# EAGLE design Main_board (EAGLE 7.4.0)
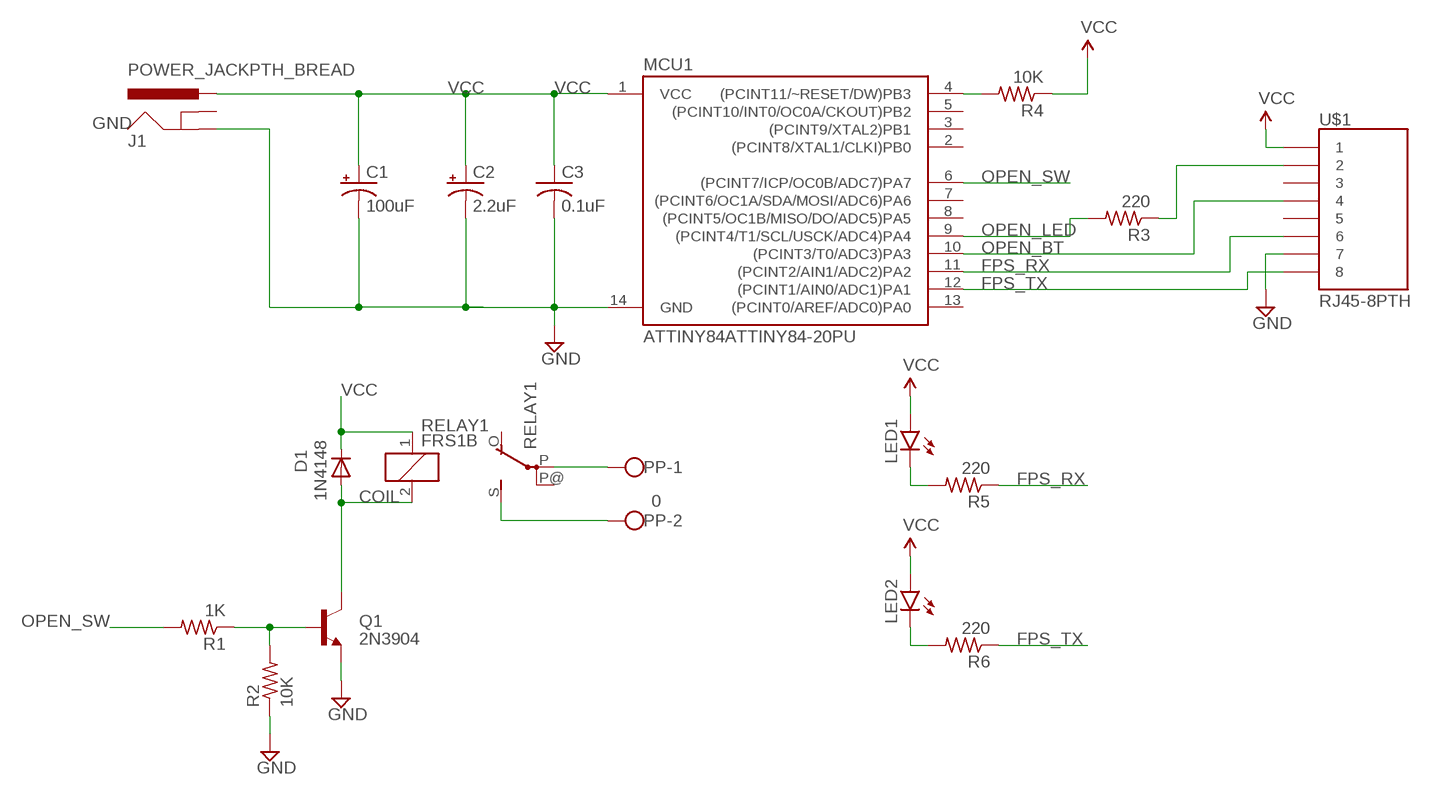
[diagram p0: schematic, sheet 1]

## Parts
C1  100uF  CAP_POLPTH2  [CPOL-RADIAL-10UF-25V]
C2  2.2uF  CAP_POLPTH2  [CPOL-RADIAL-10UF-25V]
C3  0.1uF  C-US025-024X044  [C025-024X044]
D1  1N4148  DIODE1N4148  [DIODE-1N4148]
J1  POWER_JACKPTH_BREAD  [POWER_JACK_PTH_BREAD]
LED1  LED3MM  [LED3MM]
LED2  LED3MM  [LED3MM]
MCU1  ATTINY84ATTINY84-20PU  [DIL14]
PP  0  W237-102  [W237-102]
Q1  2N3904  TRANSISTOR_NPNTO92  [TO-92]
R1  1K  R-US_0207/10  [0207/10]
R2  10K  R-US_0207/10  [0207/10]
R3  220  R-US_0207/10  [0207/10]
R4  10K  R-US_0207/10  [0207/10]
R5  220  R-US_0207/10  [0207/10]
R6  220  R-US_0207/10  [0207/10]
RELAY1  FRS1B  [FRS1B]
U$1  RJ45-8PTH  [RJ45-8]

## Nets
COIL [power]: D1.A Q1.3(C) RELAY1.2
FPS_RX: MCU1.11((PCINT2/AIN1/ADC2)PA2) R5.1 U$1.6
FPS_TX: MCU1.12((PCINT1/AIN0/ADC1)PA1) R6.1 U$1.8
GND [power]: C1.2(-) C2.2(-) C3.2 J1.GND MCU1.14(GND) Q1.1(E) R2.1 U$1.7
N$1: Q1.2(B) R1.1 R2.2
N$2 [power]: PP.2 RELAY1.S(2:S)
N$3 [power]: PP.1 RELAY1.P(2:P)
N$4: LED2.K(C) R6.2
N$5: MCU1.4((PCINT11/~RESET/DW)PB3) R4.2
N$6: LED1.K(C) R5.2
N$10: R3.1 U$1.2
OPEN_BT: MCU1.10((PCINT3/T0/ADC3)PA3) U$1.4
OPEN_LED: MCU1.9((PCINT4/T1/SCL/USCK/ADC4)PA4) R3.2
OPEN_SW: MCU1.6((PCINT7/ICP/OC0B/ADC7)PA7) R1.2
VCC [power]: C1.1(+) C2.1(+) C3.1 D1.C J1.PWR LED1.A LED2.A MCU1.1(VCC) R4.1 RELAY1.1 U$1.1
Unconnected: J1.GNDBREAK MCU1.2((PCINT8/XTAL1/CLKI)PB0) MCU1.3((PCINT9/XTAL2)PB1) MCU1.5((PCINT10/INT0/OC0A/CKOUT)PB2) MCU1.7((PCINT6/OC1A/SDA/MOSI/ADC6)PA6) MCU1.8((PCINT5/OC1B/MISO/DO/ADC5)PA5) MCU1.13((PCINT0/AREF/ADC0)PA0) RELAY1.O(2:O) RELAY1.P@(2:P) U$1.3 U$1.5

## Library data of the parts
C1 C2 = SparkFun-Capacitors:CAP_POL: Capacitor Polarized These are standard SMD and PTH capacitors. Normally 10uF, 47uF, and 100uF in electrolytic and tantalum varieties. Always verify the external diameter of the through hole cap, it varies with capacity, voltage, and manufacturer. The EIA devices should be standard.
C3 = adafruit:C-US: CAPACITOR, American symbol
D1 = SparkFun:DIODE: Diode These are standard reverse protection diodes and small signal diodes. SMA package can handle up to about 1A. SOD-323 can handle about 200mA. What the SOD-323 package when ordering, there are some mfgs out there that are 5-pin packages.
J1 = SparkFun-Connectors:POWER_JACK: Power Jack This is the standard 5.5mm barrel jack for power. The PTH is the most common, proven, reliable, footprint. The Slot footprint only works if the mill layer is transmitted to the PCB fab house so be warned. Mating wall wart : TOL-00298 (and others); PROD_ID: PRT-10811
LED1 LED2 = SparkFun-LED:LED: LEDs Standard schematic elements and footprints for 5mm, 3mm, 1206, and 0603 sized LEDs. 5mm - Spark Fun Electronics SKU : COM-00529 (and others)
MCU1 = SparkFun-DigitalIC:ATTINY84: Atmel 14-pin 2/4/8kB flash uC
PP = con-wago-500:W237-102: WAGO SCREW CLAMP
Q1 = SparkFun:TRANSISTOR_NPN: Transistor NPN BJT configuration in SOT23 package. MMBT2222 is the common NPN we use. Double check BCE configuration again layout.
R1-R6 = rcl:R-US_: RESISTOR, American symbol
RELAY1 = relay:FRS1B: RELAY 1 x switch, same as V23101-D6-A201, Siemens
U$1 = SparkFun-Connectors:RJ45-8: RJ45 Jack Simple RJ45, 8-pin connection - connector for common Cat5, Cat5e, and Cat6 Ethernet cables. Footprint not yet proven in production. Connector sku is PRT-00643; Breakout PCB sku is BOB-00716.

## Net classes
0 signal: width 0.381 mm, drill 0.508 mm, clearance 0.254 mm
1 power: width 0.635 mm, drill 0.508 mm, clearance 0.559 mm

## Board
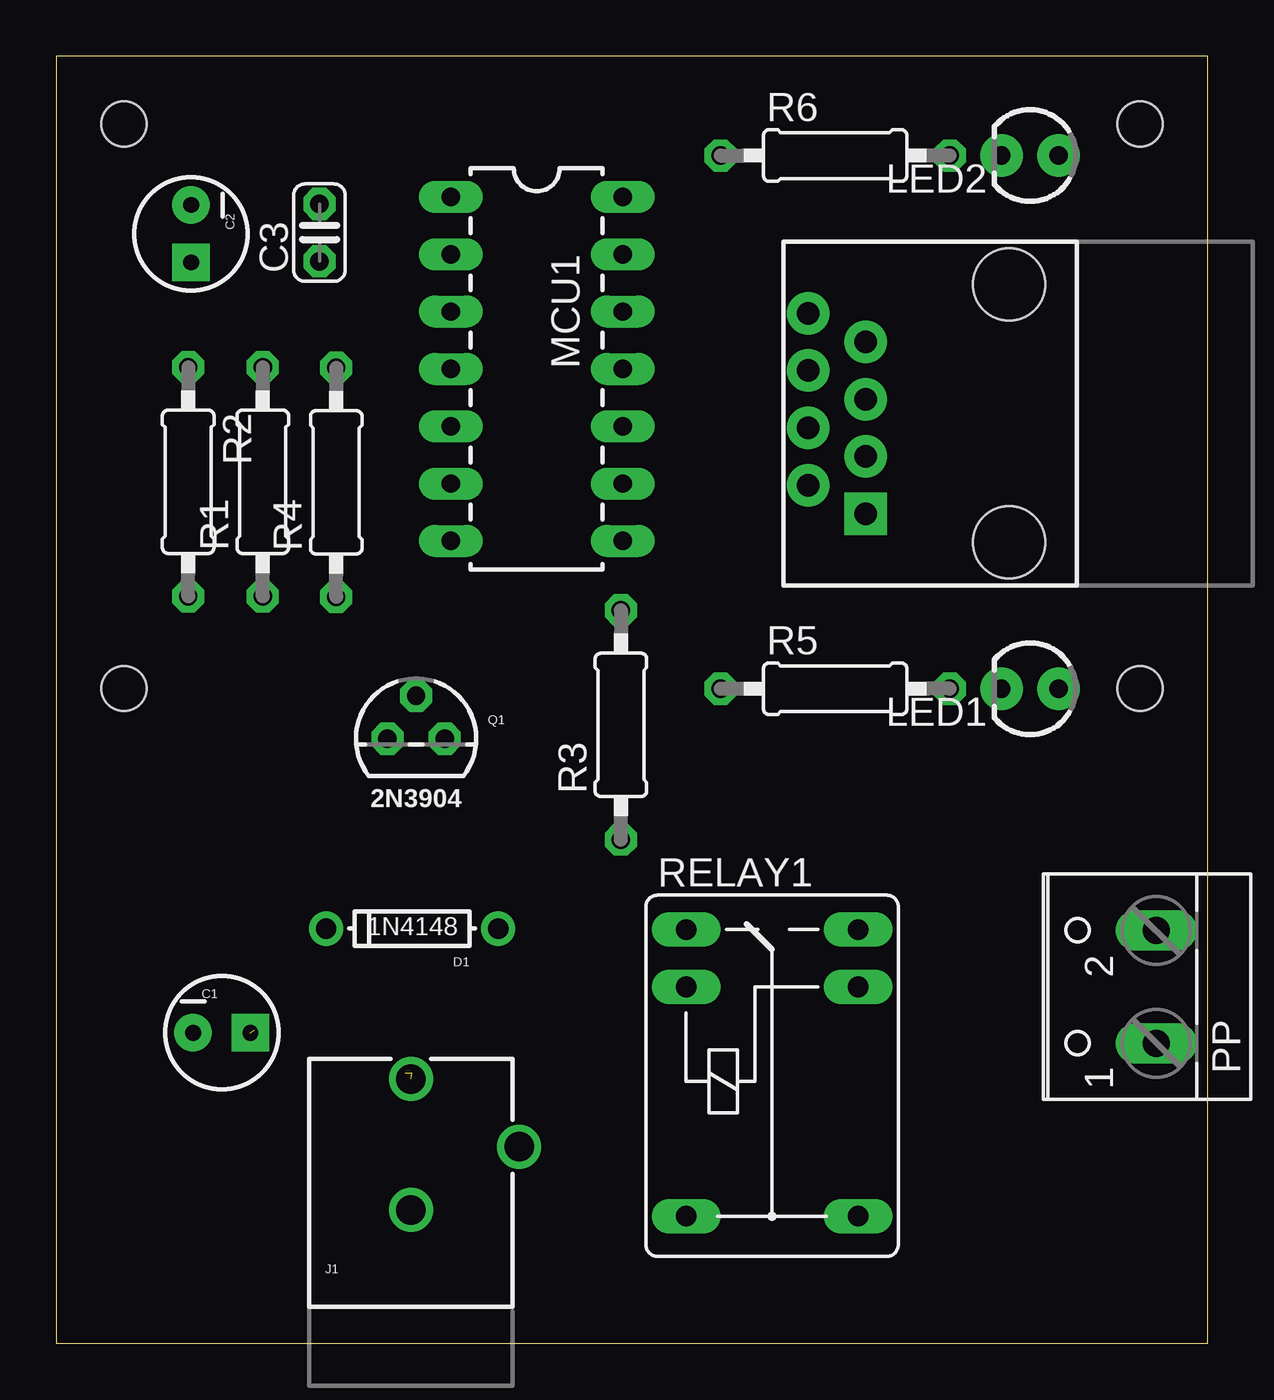
[diagram p1: board, top side]
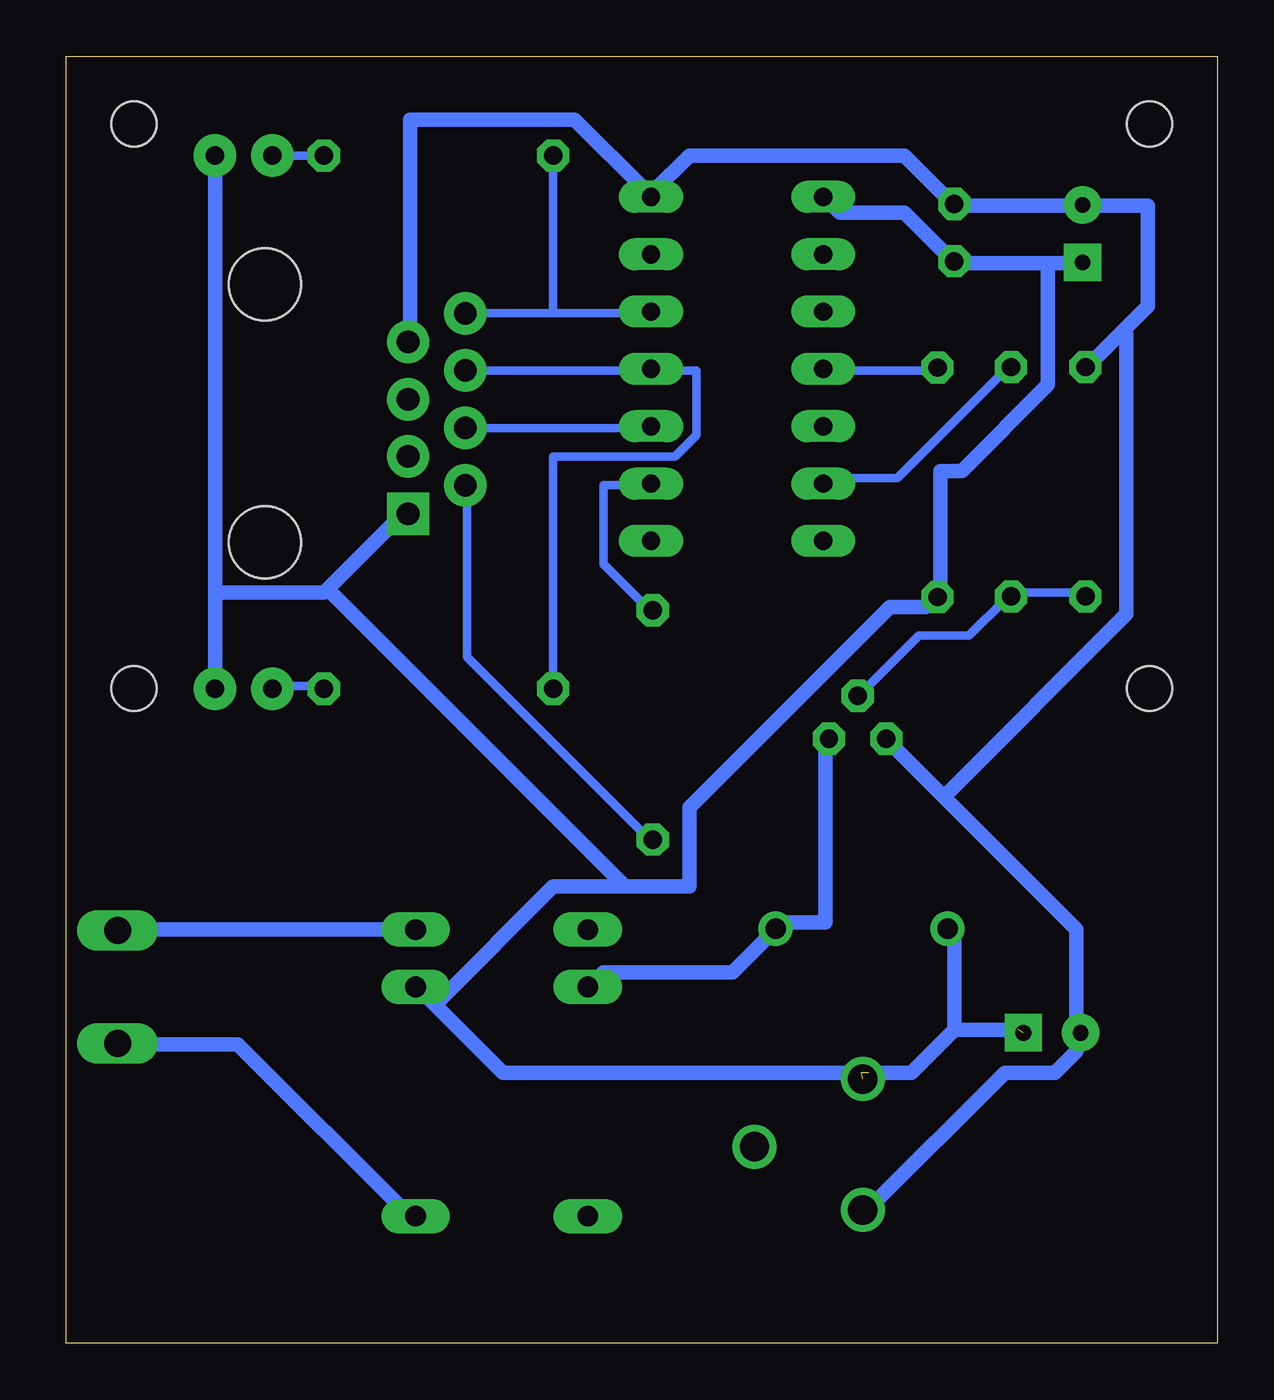
[diagram p2: board, bottom side, seen from below]

Size 51 x 57 mm. Coordinates in mm from the lower left corner, seen from the top.
Outline: 0,0 51,0 51,57 0,57 0,0
Copper layers (1*16): Top 0.035mm / dielectric 1.5mm / Bottom 0.035mm
Design rules "SparkFun-2-layer": minimum track width 7mil, minimum drill 15mil, track to track 8mil, track to pad 8mil, pad to pad 8mil, via to via 8mil, smd to smd 8mil, copper to edge 8mil, drill to drill 8mil, minimum pad ring 12mil, minimum via ring 10mil, stop-mask expansion 4mil, vias tented up to drill 20mil, thermal gap 10mil
Holes 2 mm at 3,29 48,29 48,54 3,54

### Footprints (pad centres in the part's own frame; a part is rotated, then mirrored left to right if it is on the bottom)
CPOL-RADIAL-10UF-25V = drill 0.7 pad 1.651 square: 1 1.27,0 | drill 0.7 pad 1.651: 2 -1.27,0
C025-024X044 = drill 0.813 pad 1.422 octagon: 1 -1.27,0; 2 1.27,0
DIODE-1N4148 = drill 0.9: A -3.81,0; C 3.81,0
POWER_JACK_PTH_BREAD = drill 1.3: GND 0,7.9; GNDBREAK 4.8,10.7; PWR 0,13.7
LED3MM = drill 0.813 pad 1.88: A -1.27,0; K 1.27,0
DIL14 = drill 0.813 long: 1 -8.89,-3.81; 2 -6.35,-3.81; 3 -3.81,-3.81; 4 -1.27,-3.81; 5 1.27,-3.81; 6 3.81,-3.81; 7 6.35,-3.81; 8 6.35,3.81; 9 3.81,3.81; 10 1.27,3.81; 11 -1.27,3.81; 12 -3.81,3.81; 13 -6.35,3.81; 14 -8.89,3.81
W237-102 = drill 1.194 long: 1 -2.5,-1.27; 2 2.5,-1.27
TO-92 = drill 0.813 octagon: 1 -1.27,0; 2 0,1.905; 3 1.27,0
0207/10 = drill 0.813 octagon: 1 -5.08,0; 2 5.08,0
FRS1B = drill 0.914 long: 1 0,3.81; 2 0,-3.81; O -2.54,-3.81; P 10.16,3.81; P@ 10.16,-3.81; S -2.54,3.81
RJ45-8 = drill 1 pad 1.88 square: 1 -4.445,6.35 | drill 1 pad 1.88: 2 -3.175,8.89; 3 -1.905,6.35; 4 -0.635,8.89; 5 0.635,6.35; 6 1.905,8.89; 7 3.175,6.35; 8 4.445,8.89 | hole 3.2: -5.715,0; 5.715,0

### Placement (x,y rotation side)
C1  7.32,13.75 0 top
C2  5.96,49.15 270 top
C3  11.65,49.19 90 top
D1  15.76,18.36 180 top
J1  15.7,-2 0 top
LED1  43.14,28.99 180 top
LED2  43.14,52.61 180 top
MCU1  21.28,41.89 270 top
PP  47.45,15.78 90 top
Q1  15.93,26.77 0 top
R1  9.14,38.16 90 top
R2  5.84,38.16 270 top
R3  25.01,27.39 90 top
R4  12.39,38.13 90 top
R5  34.5,28.99 0 top
R6  34.5,52.61 0 top
RELAY1  31.71,15.78 270 top
U$1  42.2,41.18 90 top

### Tracks (layer width: path | path; a pad name or v marks a point on that pad's centre or on a via)
COIL
  Bottom 0.635: Q1.3 17.35,26.57 17.35,18.64 19.26,18.64 D1.A 19.58,18.32 21.48,16.41 27.2,16.41 27.83,15.78 RELAY1.2
FPS_RX
  Bottom 0.381: U$1.6 25.29,43.09 MCU1.11 24.98,43.09 23.07,43.09 23.07,40.23 24.02,39.27 29.42,39.27 R5.1
FPS_TX
  Bottom 0.381: U$1.8 29.42,45.62 | 29.42,45.62 25.29,45.62 MCU1.12 | 29.42,45.62 R6.1
GND
  Bottom 0.635: 12.12,24.19 6.24,18.32 6.24,13.88 C1.2 6.24,13.56 6.24,12.92 7.2,11.97 9.42,11.97 15.45,5.94 J1.GND | 12.12,24.19 14.5,26.57 Q1.1 | 4.18,44.83 3.07,45.94 3.07,50.39 5.92,50.39 C2.2 6.24,50.39 11.64,50.39 C3.2 11.96,50.7 13.86,52.61 23.39,52.61 24.98,51.02 MCU1.14 25.29,51.02 28.47,54.2 35.77,54.2 35.77,44.35 U$1.7 | 4.18,44.83 5.61,43.4 R2.1 | 12.12,24.19 4.02,32.29 4.02,44.67 4.18,44.83
N$1
  Bottom 0.381: R2.2 5.92,33.24 9.1,33.24 R1.1 9.42,32.92 11.01,31.34 13.23,31.34 15.77,28.8 Q1.2
N$2
  Bottom 0.635: RELAY1.S 48.15,18.32 PP.2
N$3
  Bottom 0.635: RELAY1.P 35.77,5.62 43.39,13.24 48.15,13.24 PP.1
N$4
  Bottom 0.381: LED2.K R6.2
N$5
  Bottom 0.381: MCU1.4 17.35,43.09 12.59,43.09 R4.2
N$6
  Bottom 0.381: R5.2 39.58,29.11 41.87,29.11 LED1.K
N$10
  Bottom 0.381: R3.1 25.29,22.45 33.23,30.38 33.23,38.01 U$1.2
OPEN_BT
  Bottom 0.381: U$1.4 25.29,40.55 MCU1.10
OPEN_LED
  Bottom 0.381: R3.2 25.29,32.61 27.2,34.51 27.2,38.01 25.29,38.01 MCU1.9
OPEN_SW
  Bottom 0.381: R1.2 9.42,43.09 14.18,38.32 17.35,38.32 MCU1.6
VCC  (3 unrouted)
  Bottom 0.635: 44.41,33.24 LED1.A | 44.41,33.24 39.58,33.24 39.42,33.4 | 39.42,33.4 36.09,36.73 U$1.1 | 44.41,33.24 LED2.A | 7.51,47.85 7.51,42.45 11.32,38.64 12.27,38.64 12.27,33.24 R4.1 12.59,32.92 12.91,32.61 14.5,32.61 23.39,23.72 23.39,20.23 26.24,20.23 | 7.51,47.85 6.24,47.85 C2.1 | 7.51,47.85 11.64,47.85 C3.1 11.96,48.16 13.86,50.07 16.72,50.07 17.35,50.7 MCU1.1 | 11.64,13.88 11.64,18.32 D1.C | 8.78,13.88 11.64,13.88 | 15.77,11.97 31.64,11.97 35.45,15.78 RELAY1.1 34.5,15.14 29.42,20.23 26.24,20.23 | 11.64,13.88 13.55,11.97 15.45,11.97 | 26.24,20.23 39.42,33.4